# Altium schematic sheet Schematic.SchDoc
size A
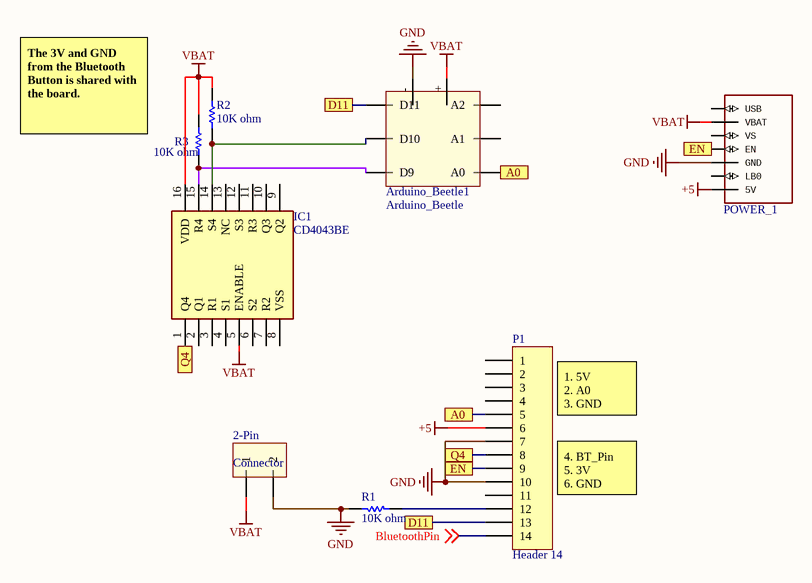
[diagram p0: Schematic.SchDoc]

## Parts
2-Pin  Connector  [Header Header 2 Pin]
Arduino_Beetle1  Arduino_Beetle  [Arduino_Beetle]
IC1  CD4043BE  [DIP794W53P254L1930H508Q16N]
P1  Header 14  [HDR1X14]
POWER_1  ADAFRUIT_POWER_BOOST  [ADAFRUIT_POWER_BOOST_1000C 2]  (value not drawn)
R1  10K ohm  [10K Resistor]
R2  10K ohm  [10K Resistor]
R3  10K ohm  [10K Resistor]

## Ports
A0, D11, EN, Q4, Q4 (out)

## Nets
+5: P1.6 POWER_1.5V
GND: 2-Pin.2 Arduino_Beetle1.- P1.7 P1.10 POWER_1.GND R1.1
VBAT: 2-Pin.1 Arduino_Beetle1.+ IC1.5(ENABLE) IC1.16(VDD) POWER_1.VBAT R2.2 R3.2
A0: Arduino_Beetle1.6(A0) P1.5 ; port A0
BluetoothPin: P1.14 ; off-sheet BluetoothPin
D11: Arduino_Beetle1.1(D11) P1.13 ; port D11
EN: P1.9 POWER_1.EN ; port EN
Q4: IC1.1(Q4) P1.8 ; port Q4
NetArduino_Beetle1_2: Arduino_Beetle1.2(D10) IC1.14(S4) R2.1
NetArduino_Beetle1_3: Arduino_Beetle1.3(D9) IC1.15(R4) R3.1
NetP1_12: P1.12 R1.2

Not connected (* = marked no-connect by the designer): Arduino_Beetle1 4(A2) 5(A1); IC1 2(Q1) 3(R1) 4(S1) 6(S2) 7(R2) 8(VSS) 9(Q2) 10(Q3) 11(R3) 12(S3) 13(NC); P1 1 2 3 4 11; POWER_1 LB0 USB VS

## Notes on the sheet
- The 3V and GND from the Bluetooth Button is shared with the board.
- (near P1) 1. 5V
  2. A0
  3. GND
- (near P1) 4. BT_Pin
  5. 3V
  6. GND

## Library data of the parts
2-Pin = 2-Pin: 2-Pin connector with the spacing of one 2.54mm through hole
IC1 = CD4043BE: Integrated Circuit; Manufacturer_Name: Texas Instruments; Datasheet Link: http://www.ti.com/lit/ds/symlink/cd4043b.pdf; Height: 5.08mm; Manufacturer_Part_Number: CD4043BE; Arrow Part Number: CD4043BE; Arrow Price/Stock: https://www.arrow.com/en/products/cd4043be/texas-instruments; Mouser Part Number: 595-CD4043BE; Mouser Price/Stock: https://www.mouser.co.uk/ProductDetail/Texas-Instruments/CD4043BE?qs=5h8QSfodyRh52gnjNYecnw%3D%3D; Supplier 1: Digi-Key; Supplier Part Number 1: 296-2050-ND
P1 = Header 14: Header, 14-Pin; LatestRevisionDate: 17-Jul-2002; LatestRevisionNote: Re-released for DXP Platform.; Publisher: Altium Limited
POWER_1 = ADAFRUIT_POWER_BOOST: GateName_1: G$1; SymbolName_1: ADAFRUIT_POWER_BOOST; LibraryName: adafruit_power_1000c; DeviceSetName: ADAFRUIT_POWER_BOOST; Package: ADAFRUIT_POWER_BOOST_1000C
R1-R3 = 10K: Through-Hole; Supplier 1: Digi-Key; Supplier Part Number 1: 10.0KXBK-ND